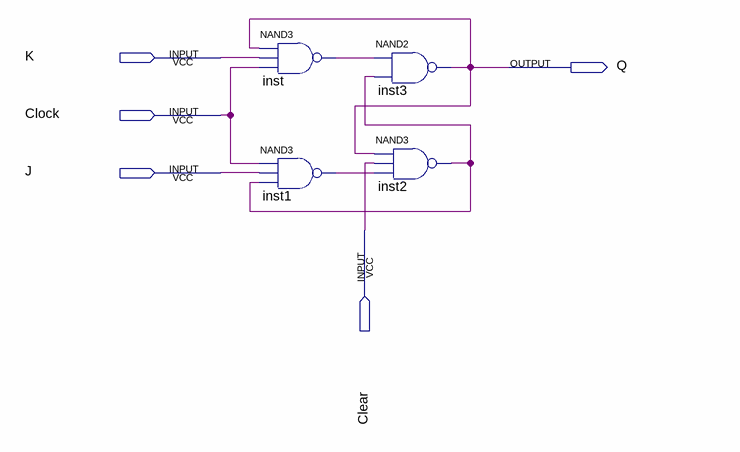
[diagram p0: schematic sheet]
// Quartus schematic FFJK.bdf as structural Verilog: 4 symbols, 5 pins
module FFJK (
  input  K,
  input  Clock,
  input  J,
  input  Clear,
  output Q
);

  wire inst1_out, inst2_out, inst_out;

  nand inst (inst_out, Q, K, Clock);
  nand inst1 (inst1_out, Clock, J, inst2_out);
  nand inst3 (Q, inst_out, inst2_out);
  nand inst2 (inst2_out, Q, Clear, inst1_out);
endmodule
